# Altium schematic sheet rs485.SchDoc
size A4
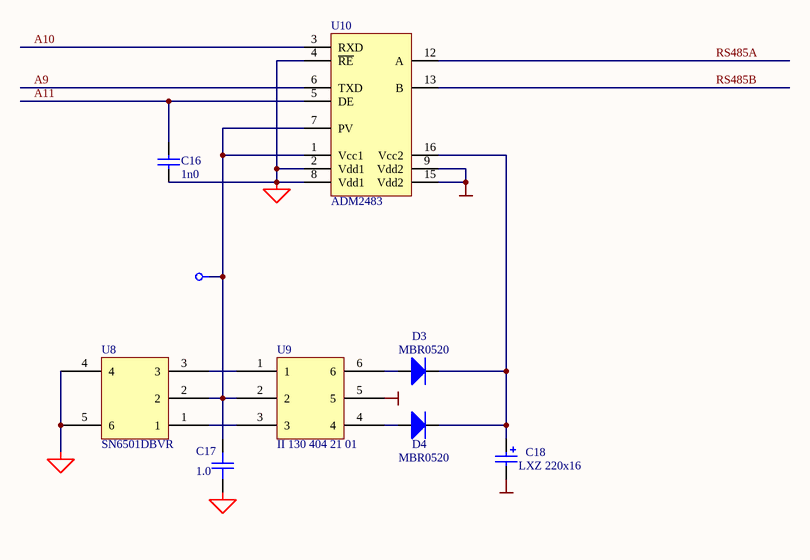
[diagram p0: rs485.SchDoc]

## Parts
C16  1n0  [_1206]
C17  1.0  [_1206]
C18  LXZ 220x16  [el3]
D3  MBR0520  [_1206d]
D4  MBR0520  [_1206d]
U8  SN6501DBVR  [SO-G5/P.95]
U9  II 130 404 21 01  [II1304042101]
U10  ADM2483  [SO-G16/D10.4]

## Nets
+5v: C17.2 U8.2 U9.2 U10.1(Vcc1) U10.7(PV)
GND: C16.1 C17.1 U8.4 U8.5(6) U10.2(Vdd1) U10.4(~{RE}) U10.8(Vdd1)
GND_485: C18.2 U9.5 U10.9(Vdd2) U10.15(Vdd2)
A9: U10.6(TXD)
A10: U10.3(RXD)
A11: C16.2 U10.5(DE)
RS485A: U10.12(A)
RS485B: U10.13(B)
NetC18_1: C18.1 D3.2(K) D4.2(K) U10.16(Vcc2)
NetD3_1: D3.1(A) U9.6
NetD4_1: D4.1(A) U9.4
NetU8_1: U8.1 U9.3
NetU8_3: U8.3 U9.1

Not connected (* = marked no-connect by the designer): U8 6(5)

## Library data of the parts
C16 = Cap Semi: Capacitor (Semiconductor SIM Model); Manufacturer: Generic Components; Class I: Passive; Value: 1,0; Published: 8-Jun-2000; Revision: July-2002: Re-released for DXP Platform.; Publisher: Altium Limited; Class II: Capacitor
C17 = C_SM_1206: value: 1u
C18 = Cap Pol1: Polarized Capacitor (Radial); Manufacturer: Generic Components; Class I: Passive; Value: 22,0x50; Published: 8-Jun-2000; Revision: July-2002: Re-released for DXP Platform.; Publisher: Altium Limited; Class II: Capacitor
D3 D4 = Diode: Default Diode; Manufacturer: Generic Components; Class I: Discrete; Class II: Diode - Switching; Published: 8-Jun-2000; Revision: July-2002: Re-released for DXP Platform.; Publisher: Altium Limited
U8 U9 = PIN6